# Altium schematic sheet TopLevelSchem.SchDoc
size Letter; DrawnBy: Adam Gilbert; Organization: Altium Limited; Address1: L3, 12a Rodborough Rd; Address2: Frenchs Forest; Address3: NSW; Address4: Australia 2086; DocumentNumber: 1; SheetNumber: 1; SheetTotal: 4
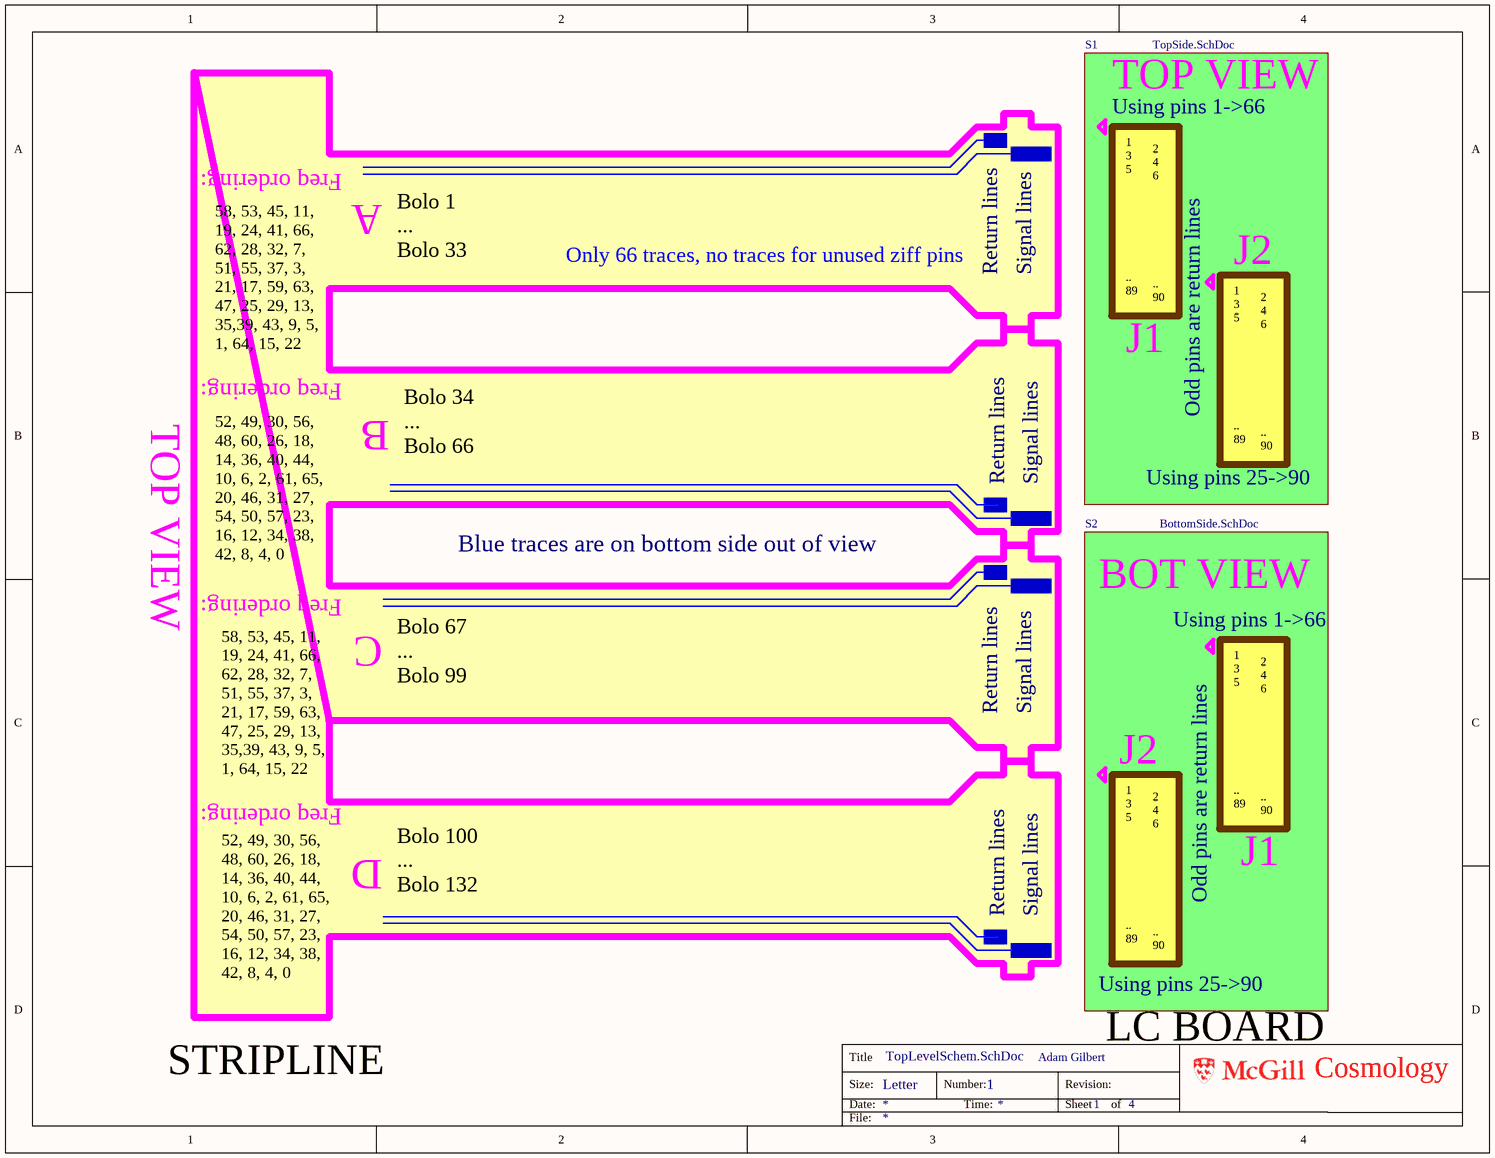
[diagram p0: TopLevelSchem.SchDoc]

## Sub-sheets
S1 = TopSide.SchDoc: no entries
S2 = BottomSide.SchDoc: no entries

## Notes on the sheet
- TOP VIEW
- Freq ordering:
- Using pins 1->66
- A
- Bolo 1
  ...
  Bolo 33
- Only 66 traces, no traces for unused ziff pins
- Return lines
- Signal lines
- J2
- 58, 53, 45, 11, 19, 24, 41, 66, 62, 28, 32, 7, 51, 55, 37, 3, 21, 17, 59, 63, 47, 25, 29, 13, 35,39, 43, 9, 5, 1, 64, 15, 22
- 1
  3
  5
  ..
  89
- J1
- 2
  4
  6
  ..
  90
- B
- Odd pins are return lines
- Bolo 34
  ...
  Bolo 66
- Using pins 25->90
- Blue traces are on bottom side out of view
- 52, 49, 30, 56, 48, 60, 26, 18, 14, 36, 40, 44, 10, 6, 2, 61, 65, 20, 46, 31, 27, 54, 50, 57, 23, 16, 12, 34, 38, 42, 8, 4, 0
- C
- BOT VIEW
- Bolo 67
  ...
  Bolo 99
- D
- Bolo 100
  ...
  Bolo 132
- LC BOARD
- STRIPLINE
- Title
- Size:
- Date:
- Letter
- Number:
- Time:
- Revision:
- Sheet
- of
- Cosmology
- File: